# Altium schematic sheet Holoboard_peripherals.SchDoc
size A3
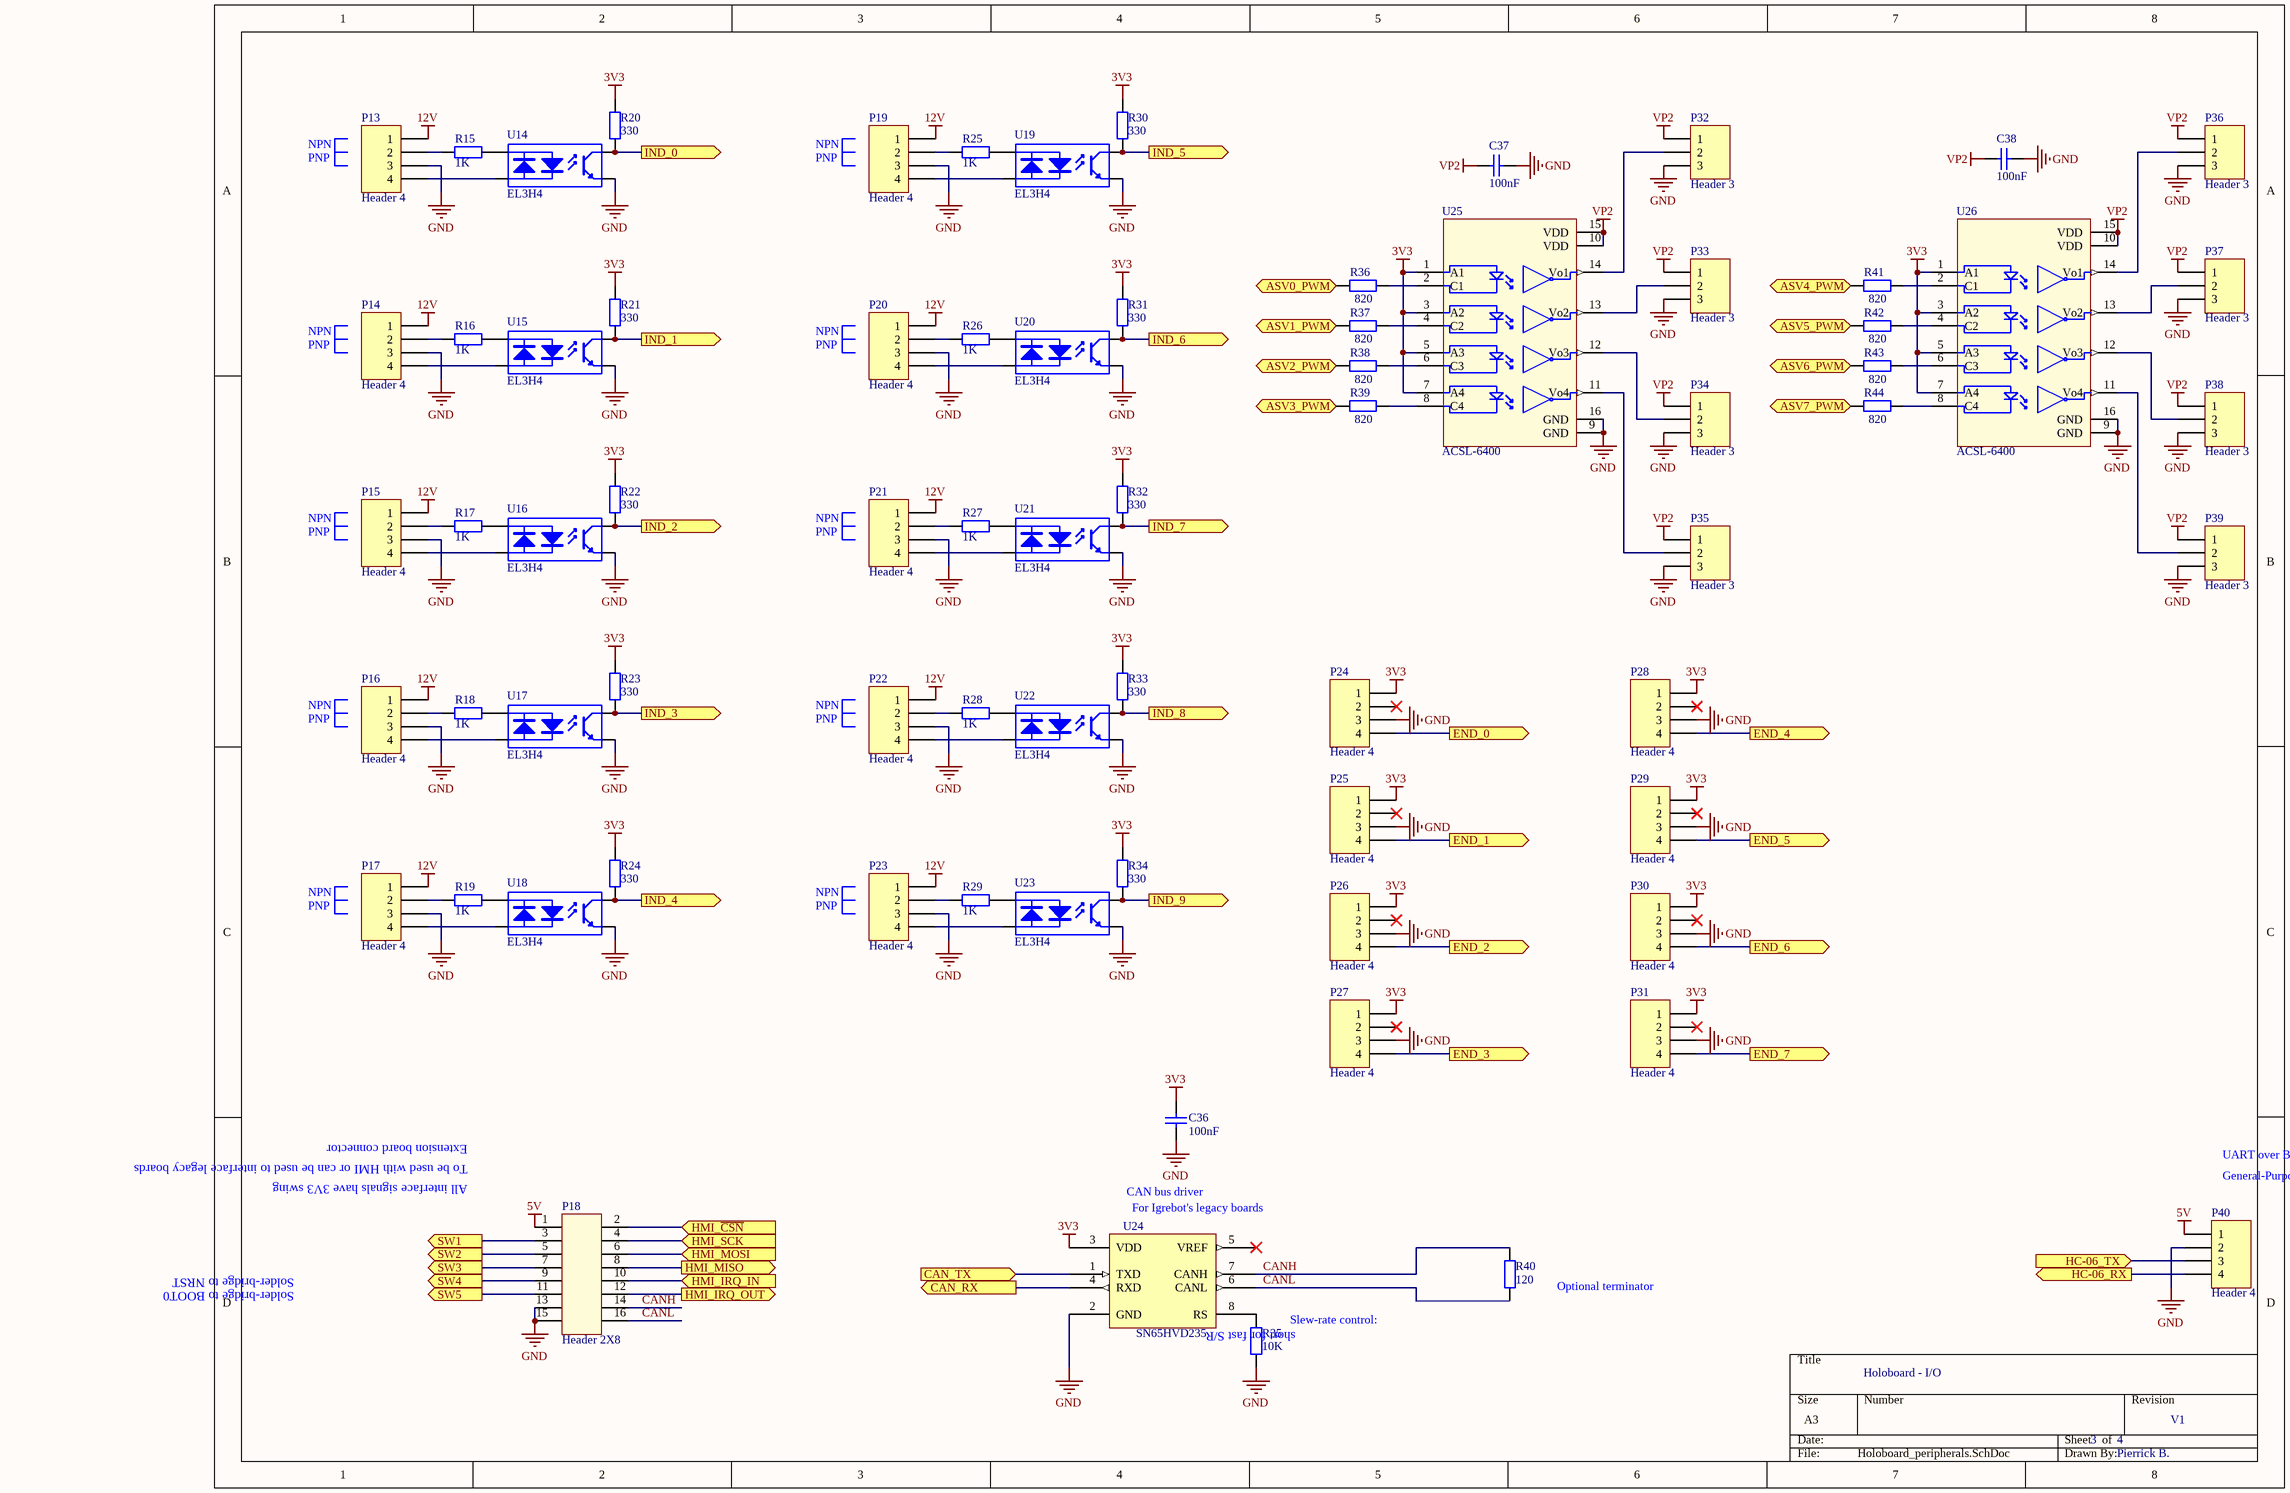
[diagram p0: Holoboard_peripherals.SchDoc]

## Parts
C36  value 100nF  [C0603]  (hidden comment: Cap)
C37  value 100nF  [C0603]  (hidden comment: Cap)
C38  value 100nF  [C0603]  (hidden comment: Cap)
P13  Header 4  [7-215079-4]
P14  Header 4  [7-215079-4]
P15  Header 4  [7-215079-4]
P16  Header 4  [7-215079-4]
P17  Header 4  [7-215079-4]
P18  Header 2X8  [HDR2X8]
P19  Header 4  [7-215079-4]
P20  Header 4  [7-215079-4]
P21  Header 4  [7-215079-4]
P22  Header 4  [7-215079-4]
P23  Header 4  [7-215079-4]
P24  Header 4  [7-215079-4]
P25  Header 4  [7-215079-4]
P26  Header 4  [7-215079-4]
P27  Header 4  [7-215079-4]
P28  Header 4  [7-215079-4]
P29  Header 4  [7-215079-4]
P30  Header 4  [7-215079-4]
P31  Header 4  [7-215079-4]
P32  Header 3  [HDR1X3]
P33  Header 3  [HDR1X3]
P34  Header 3  [HDR1X3]
P35  Header 3  [HDR1X3]
P36  Header 3  [HDR1X3]
P37  Header 3  [HDR1X3]
P38  Header 3  [HDR1X3]
P39  Header 3  [HDR1X3]
P40  Header 4  [HDR1X4]
R15  value 1K  [0603]  (hidden comment: Res2)
R16  value 1K  [0603]  (hidden comment: Res2)
R17  value 1K  [0603]  (hidden comment: Res2)
R18  value 1K  [0603]  (hidden comment: Res2)
R19  value 1K  [0603]  (hidden comment: Res2)
R20  value 330  [0603]  (hidden comment: Res2)
R21  value 330  [0603]  (hidden comment: Res2)
R22  value 330  [0603]  (hidden comment: Res2)
R23  value 330  [0603]  (hidden comment: Res2)
R24  value 330  [0603]  (hidden comment: Res2)
R25  value 1K  [0603]  (hidden comment: Res2)
R26  value 1K  [0603]  (hidden comment: Res2)
R27  value 1K  [0603]  (hidden comment: Res2)
R28  value 1K  [0603]  (hidden comment: Res2)
R29  value 1K  [0603]  (hidden comment: Res2)
R30  value 330  [0603]  (hidden comment: Res2)
R31  value 330  [0603]  (hidden comment: Res2)
R32  value 330  [0603]  (hidden comment: Res2)
R33  value 330  [0603]  (hidden comment: Res2)
R34  value 330  [0603]  (hidden comment: Res2)
R35  value 10K  [0603]  (hidden comment: Res2)
R36  value 820  [0603]  (hidden comment: Res2)
R37  value 820  [0603]  (hidden comment: Res2)
R38  value 820  [0603]  (hidden comment: Res2)
R39  value 820  [0603]  (hidden comment: Res2)
R40  value 120  [0603]  (hidden comment: Res2)
R41  value 820  [0603]  (hidden comment: Res2)
R42  value 820  [0603]  (hidden comment: Res2)
R43  value 820  [0603]  (hidden comment: Res2)
R44  value 820  [0603]  (hidden comment: Res2)
U14  EL3H4
U15  EL3H4
U16  EL3H4
U17  EL3H4
U18  EL3H4
U19  EL3H4
U20  EL3H4
U21  EL3H4
U22  EL3H4
U23  EL3H4
U24  SN65HVD235  [SOIC150-8]
U25  ACSL-6400  [SO16]
U26  ACSL-6400  [SO16]

## Ports
ASV0_PWM (in), ASV1_PWM (in), ASV2_PWM (in), ASV3_PWM (in), ASV4_PWM (in), ASV5_PWM (in), ASV6_PWM (in), ASV7_PWM (in), CAN_RX (out), CAN_TX (in), END_0 (out), END_1 (out), END_2 (out), END_3 (out), END_4 (out), END_5 (out), END_6 (out), END_7 (out), HC-06_RX (out), HC-06_TX (in), HMI_IRQ_IN (in), HMI_IRQ_OUT (out), HMI_MISO (out), HMI_MOSI (in), HMI_SCK (in), HMI_~{CSN} (in), IND_0 (out), IND_1 (out), IND_2 (out), IND_3 (out), IND_4 (out), IND_5 (out), IND_6 (out), IND_7 (out), IND_8 (out), IND_9 (out), SW1 (out), SW2 (out), SW3 (out), SW4 (out), SW5 (out)

## Nets
3V3: C36.2 P24.1 P25.1 P26.1 P27.1 P28.1 P29.1 P30.1 P31.1 R20.1 R21.1 R22.1 R23.1 R24.1 R30.1 R31.1 R32.1 R33.1 R34.1 U24.3(VDD) U25.1(A1) U25.3(A2) U25.5(A3) U25.7(A4) U26.1(A1) U26.3(A2) U26.5(A3) U26.7(A4)
5V: P18.1 P40.1
12V: P13.1 P14.1 P15.1 P16.1 P17.1 P19.1 P20.1 P21.1 P22.1 P23.1
GND: C36.1 C37.1 C38.1 P13.3 P14.3 P15.3 P16.3 P17.3 P18.13 P18.15 P19.3 P20.3 P21.3 P22.3 P23.3 P24.3 P25.3 P26.3 P27.3 P28.3 P29.3 P30.3 P31.3 P32.3 P33.3 P34.3 P35.3 P36.3 P37.3 P38.3 P39.3 P40.2 R35.1 U14.3(E) U15.3(E) U16.3(E) U17.3(E) U18.3(E) U19.3(E) U20.3(E) U21.3(E) U22.3(E) U23.3(E) U24.2(GND) U25.9(GND) U25.16(GND) U26.9(GND) U26.16(GND)
VP2: C37.2 C38.2 P32.1 P33.1 P34.1 P35.1 P36.1 P37.1 P38.1 P39.1 U25.10(VDD) U25.15(VDD) U26.10(VDD) U26.15(VDD)
ASV0_PWM: R36.1 ; port ASV0_PWM
ASV1_PWM: R37.1 ; port ASV1_PWM
ASV2_PWM: R38.1 ; port ASV2_PWM
ASV3_PWM: R39.1 ; port ASV3_PWM
ASV4_PWM: R41.1 ; port ASV4_PWM
ASV5_PWM: R42.1 ; port ASV5_PWM
ASV6_PWM: R43.1 ; port ASV6_PWM
ASV7_PWM: R44.1 ; port ASV7_PWM
CAN_RX: U24.4(RXD) ; port CAN_RX
CAN_TX: U24.1(TXD) ; port CAN_TX
CANH: P18.14 R40.1 U24.7(CANH)
CANL: P18.16 R40.2 U24.6(CANL)
END_0: P24.4 ; port END_0
END_1: P25.4 ; port END_1
END_2: P26.4 ; port END_2
END_3: P27.4 ; port END_3
END_4: P28.4 ; port END_4
END_5: P29.4 ; port END_5
END_6: P30.4 ; port END_6
END_7: P31.4 ; port END_7
HC-06_RX: P40.4 ; port HC-06_RX
HC-06_TX: P40.3 ; port HC-06_TX
HMI_~{CSN}: P18.2 ; port HMI_~{CSN}
HMI_IRQ_IN: P18.10 ; port HMI_IRQ_IN
HMI_IRQ_OUT: P18.12 ; port HMI_IRQ_OUT
HMI_MISO: P18.8 ; port HMI_MISO
HMI_MOSI: P18.6 ; port HMI_MOSI
HMI_SCK: P18.4 ; port HMI_SCK
IND_0: R20.2 U14.4(C) ; port IND_0
IND_1: R21.2 U15.4(C) ; port IND_1
IND_2: R22.2 U16.4(C) ; port IND_2
IND_3: R23.2 U17.4(C) ; port IND_3
IND_4: R24.2 U18.4(C) ; port IND_4
IND_5: R30.2 U19.4(C) ; port IND_5
IND_6: R31.2 U20.4(C) ; port IND_6
IND_7: R32.2 U21.4(C) ; port IND_7
IND_8: R33.2 U22.4(C) ; port IND_8
IND_9: R34.2 U23.4(C) ; port IND_9
SW1: P18.3 ; port SW1
SW2: P18.5 ; port SW2
SW3: P18.7 ; port SW3
SW4: P18.9 ; port SW4
SW5: P18.11 ; port SW5
NetP13_2: P13.2 R15.2
NetP13_4: P13.4 U14.2(K)
NetP14_2: P14.2 R16.2
NetP14_4: P14.4 U15.2(K)
NetP15_2: P15.2 R17.2
NetP15_4: P15.4 U16.2(K)
NetP16_2: P16.2 R18.2
NetP16_4: P16.4 U17.2(K)
NetP17_2: P17.2 R19.2
NetP17_4: P17.4 U18.2(K)
NetP19_2: P19.2 R25.2
NetP19_4: P19.4 U19.2(K)
NetP20_2: P20.2 R26.2
NetP20_4: P20.4 U20.2(K)
NetP21_2: P21.2 R27.2
NetP21_4: P21.4 U21.2(K)
NetP22_2: P22.2 R28.2
NetP22_4: P22.4 U22.2(K)
NetP23_2: P23.2 R29.2
NetP23_4: P23.4 U23.2(K)
NetP32_2: P32.2 U25.14(Vo1)
NetP33_2: P33.2 U25.13(Vo2)
NetP34_2: P34.2 U25.12(Vo3)
NetP35_2: P35.2 U25.11(Vo4)
NetP36_2: P36.2 U26.14(Vo1)
NetP37_2: P37.2 U26.13(Vo2)
NetP38_2: P38.2 U26.12(Vo3)
NetP39_2: P39.2 U26.11(Vo4)
NetR15_1: R15.1 U14.1(A)
NetR16_1: R16.1 U15.1(A)
NetR17_1: R17.1 U16.1(A)
NetR18_1: R18.1 U17.1(A)
NetR19_1: R19.1 U18.1(A)
NetR25_1: R25.1 U19.1(A)
NetR26_1: R26.1 U20.1(A)
NetR27_1: R27.1 U21.1(A)
NetR28_1: R28.1 U22.1(A)
NetR29_1: R29.1 U23.1(A)
NetR35_2: R35.2 U24.8(RS)
NetR36_2: R36.2 U25.2(C1)
NetR37_2: R37.2 U25.4(C2)
NetR38_2: R38.2 U25.6(C3)
NetR39_2: R39.2 U25.8(C4)
NetR41_2: R41.2 U26.2(C1)
NetR42_2: R42.2 U26.4(C2)
NetR43_2: R43.2 U26.6(C3)
NetR44_2: R44.2 U26.8(C4)

Not connected (* = marked no-connect by the designer): P24 2*; P25 2*; P26 2*; P27 2*; P28 2*; P29 2*; P30 2*; P31 2*; U24 5(VREF)*

## Notes on the sheet
- NPN
- PNP
- Extension board connector
- (near P18) To be used with HMI or can be used to interface legacy boards
- (near P18) All interface signals have 3V3 swing
- UART over BLUETOOTH
- (near P40) General-Purpose debug
- CAN bus driver
- (near U24) For Igrebot's legacy boards
- Solder-bridge to NRST
- Solder-bridge to BOOT0
- (near R40) Optional terminator
- (near R35) Slew-rate control:
- (near R35) short for fast S/R
- Holoboard - I/O
- 3
- 4
- V1
- Pierrick B.

## Library data of the parts
C36-C38 = Cap: Capacitor; Published: 8-Jun-2000; LatestRevisionDate: 17-Jul-2002; LatestRevisionNote: Re-released for DXP Platform.; PackageReference: RAD-0.3; Publisher: Altium Limited
P13-P17 P19-P31 P40 = Header 4: Header, 4-Pin; LatestRevisionDate: 17-Jul-2002; LatestRevisionNote: Re-released for DXP Platform.; Publisher: Altium Limited
P32-P39 = Header 3: Header, 3-Pin; LatestRevisionDate: 17-Jul-2002; LatestRevisionNote: Re-released for DXP Platform.; Publisher: Altium Limited
R15-R44 = Res2: Resistor; Published: 8-Jun-2000; LatestRevisionDate: 17-Jul-2002; LatestRevisionNote: Re-released for DXP Platform.; PackageReference: AXIAL-0.4; Publisher: Altium Limited
  R15-R34 R36-R39 R41-R44: Supplier: FARNELL
U14-U23 = EL3H4: 4-Pin Phototransistor, AC input; Published: 24-Mar-1999; LatestRevisionDate: 04-Mar-2005; LatestRevisionNote: Sch pins 3 & 4 Swapped.; DatasheetVersion: Nov-2003; PackageReference: DIP-4; Publisher: Altium Limited
U24 = MCP2551: High Speed Can Transceiver; Published: 6-Oct-2005; DatasheetDocument: Nov-2003; PackageDocument: Oct-2005; PackageReference: SOIC150-8; Publisher: Altium Limited; Code_JEDEC: MS-012; ComponentLink1Description: Manufacturer Link; ComponentLink1URL: http://www.microchip.com; ComponentLink2Description: Datasheet; ComponentLink2URL: http://ww1.microchip.com/downloads/en/DeviceDoc/21667d.pdf